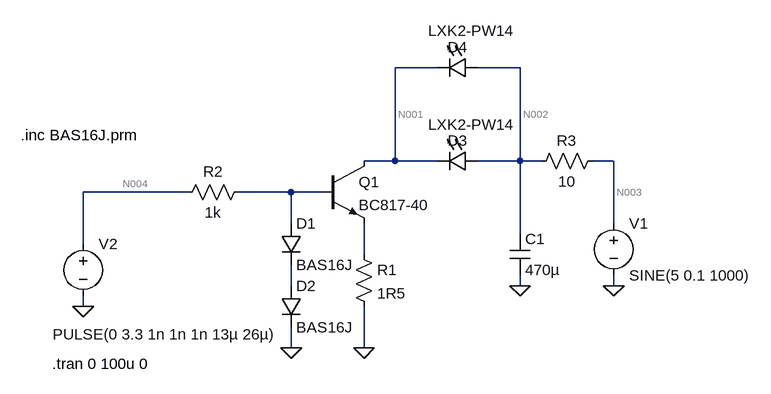
[diagram p0: schematic strom.asc]
strom.asc, the LTspice schematic file:
Version 4
SHEET 1 880 680
WIRE 368 -48 304 -48
WIRE 496 -48 432 -48
WIRE 304 96 304 -48
WIRE 304 96 256 96
WIRE 368 96 304 96
WIRE 496 96 496 -48
WIRE 496 96 432 96
WIRE 528 96 496 96
WIRE 640 96 608 96
WIRE -16 144 -176 144
WIRE 144 144 64 144
WIRE 192 144 144 144
WIRE 144 192 144 144
WIRE 640 192 640 96
WIRE 496 208 496 96
WIRE -176 224 -176 144
WIRE 256 240 256 192
WIRE 144 288 144 256
WIRE 496 288 496 272
WIRE 640 288 640 272
WIRE -176 320 -176 304
WIRE 144 384 144 352
WIRE 256 384 256 320
FLAG 144 384 0
FLAG 256 384 0
FLAG 496 288 0
FLAG 640 288 0
FLAG -176 320 0
SYMBOL npn 192 96 R0
SYMATTR InstName Q1
SYMATTR Value BC817-40
SYMBOL diode 128 192 R0
SYMATTR InstName D1
SYMATTR Value BAS16J
SYMBOL diode 128 288 R0
SYMATTR InstName D2
SYMATTR Value BAS16J
SYMBOL res 240 224 R0
SYMATTR InstName R1
SYMATTR Value 1R5
SYMBOL res -32 160 R270
WINDOW 0 32 56 VTop 2
WINDOW 3 0 56 VBottom 2
SYMATTR InstName R2
SYMATTR Value 1k
SYMBOL cap 480 208 R0
SYMATTR InstName C1
SYMATTR Value 470µ
SYMBOL sym_pal\ (1)\\voltage 640 176 R0
WINDOW 123 0 0 Left 2
WINDOW 39 0 0 Left 2
SYMATTR InstName V1
SYMATTR Value SINE(5 0.1 1000)
SYMBOL sym_pal\ (1)\\voltage -176 208 R0
WINDOW 3 -47 155 Left 2
WINDOW 123 0 0 Left 2
WINDOW 39 0 0 Left 2
SYMATTR Value PULSE(0 3.3 1n 1n 1n 13µ 26µ)
SYMATTR InstName V2
SYMBOL LED 432 80 R90
WINDOW 0 0 32 VBottom 2
WINDOW 3 -56 11 VTop 2
SYMATTR InstName D3
SYMATTR Value LXK2-PW14
SYMBOL res 512 112 R270
WINDOW 0 32 56 VTop 2
WINDOW 3 0 56 VBottom 2
SYMATTR InstName R3
SYMATTR Value 10
SYMBOL LED 432 -64 R90
WINDOW 0 0 32 VBottom 2
WINDOW 3 -56 11 VTop 2
SYMATTR InstName D4
SYMATTR Value LXK2-PW14
TEXT -224 408 Left 2 !.tran 0 100u 0
TEXT -272 56 Left 2 !.inc BAS16J.prm

The netlist it stands for:
* strom.asc
Q1 N001 N005 N006 0 BC817-40
D1 N005 N007 BAS16J
D2 N007 0 BAS16J
R1 N006 0 1R5
R2 N004 N005 1k
C1 N002 0 470µ
V1 N003 0 SINE(5 0.1 1000)
V2 N004 0 PULSE(0 3.3 1n 1n 1n 13µ 26µ)
D3 N002 N001 LXK2-PW14
R3 N002 N003 10
D4 N002 N001 LXK2-PW14
.model D D
.lib standard.dio
.model NPN NPN
.model PNP PNP
.lib standard.bjt
.tran 0 100u 0
.inc BAS16J.prm
.backanno
.end

* Results of the author's LTspice run, read from the files saved beside the schematic
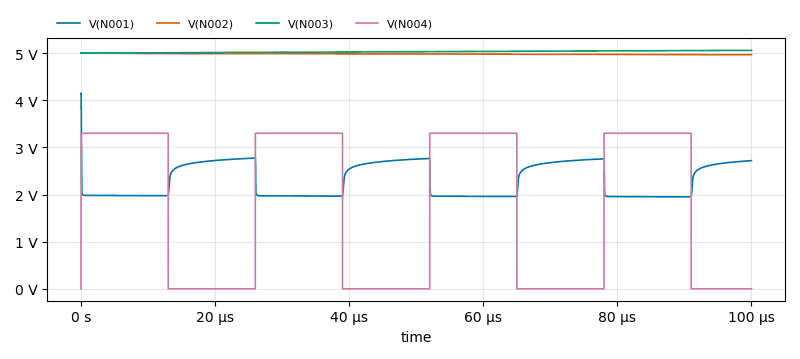
[diagram p1: Transient Analysis of strom.asc, plotted from the saved traces]
* Transient Analysis, 1 run:
*   V(N001): min 1.949 V, max 4.148 V, average 2.305 V, rms 2.333 V, last 2.719 V
*   V(N002): min 4.967 V, max 5 V, average 4.982 V, rms 4.982 V, last 4.967 V
*   V(N003): min 5 V, max 5.059 V, average 5.03 V, rms 5.03 V, last 5.059 V
*   V(N004): min 0 V, max 3.3 V, average 1.716 V, rms 2.38 V, last 0 V